# Altium schematic sheet sram_cpu.SchDoc
size A2
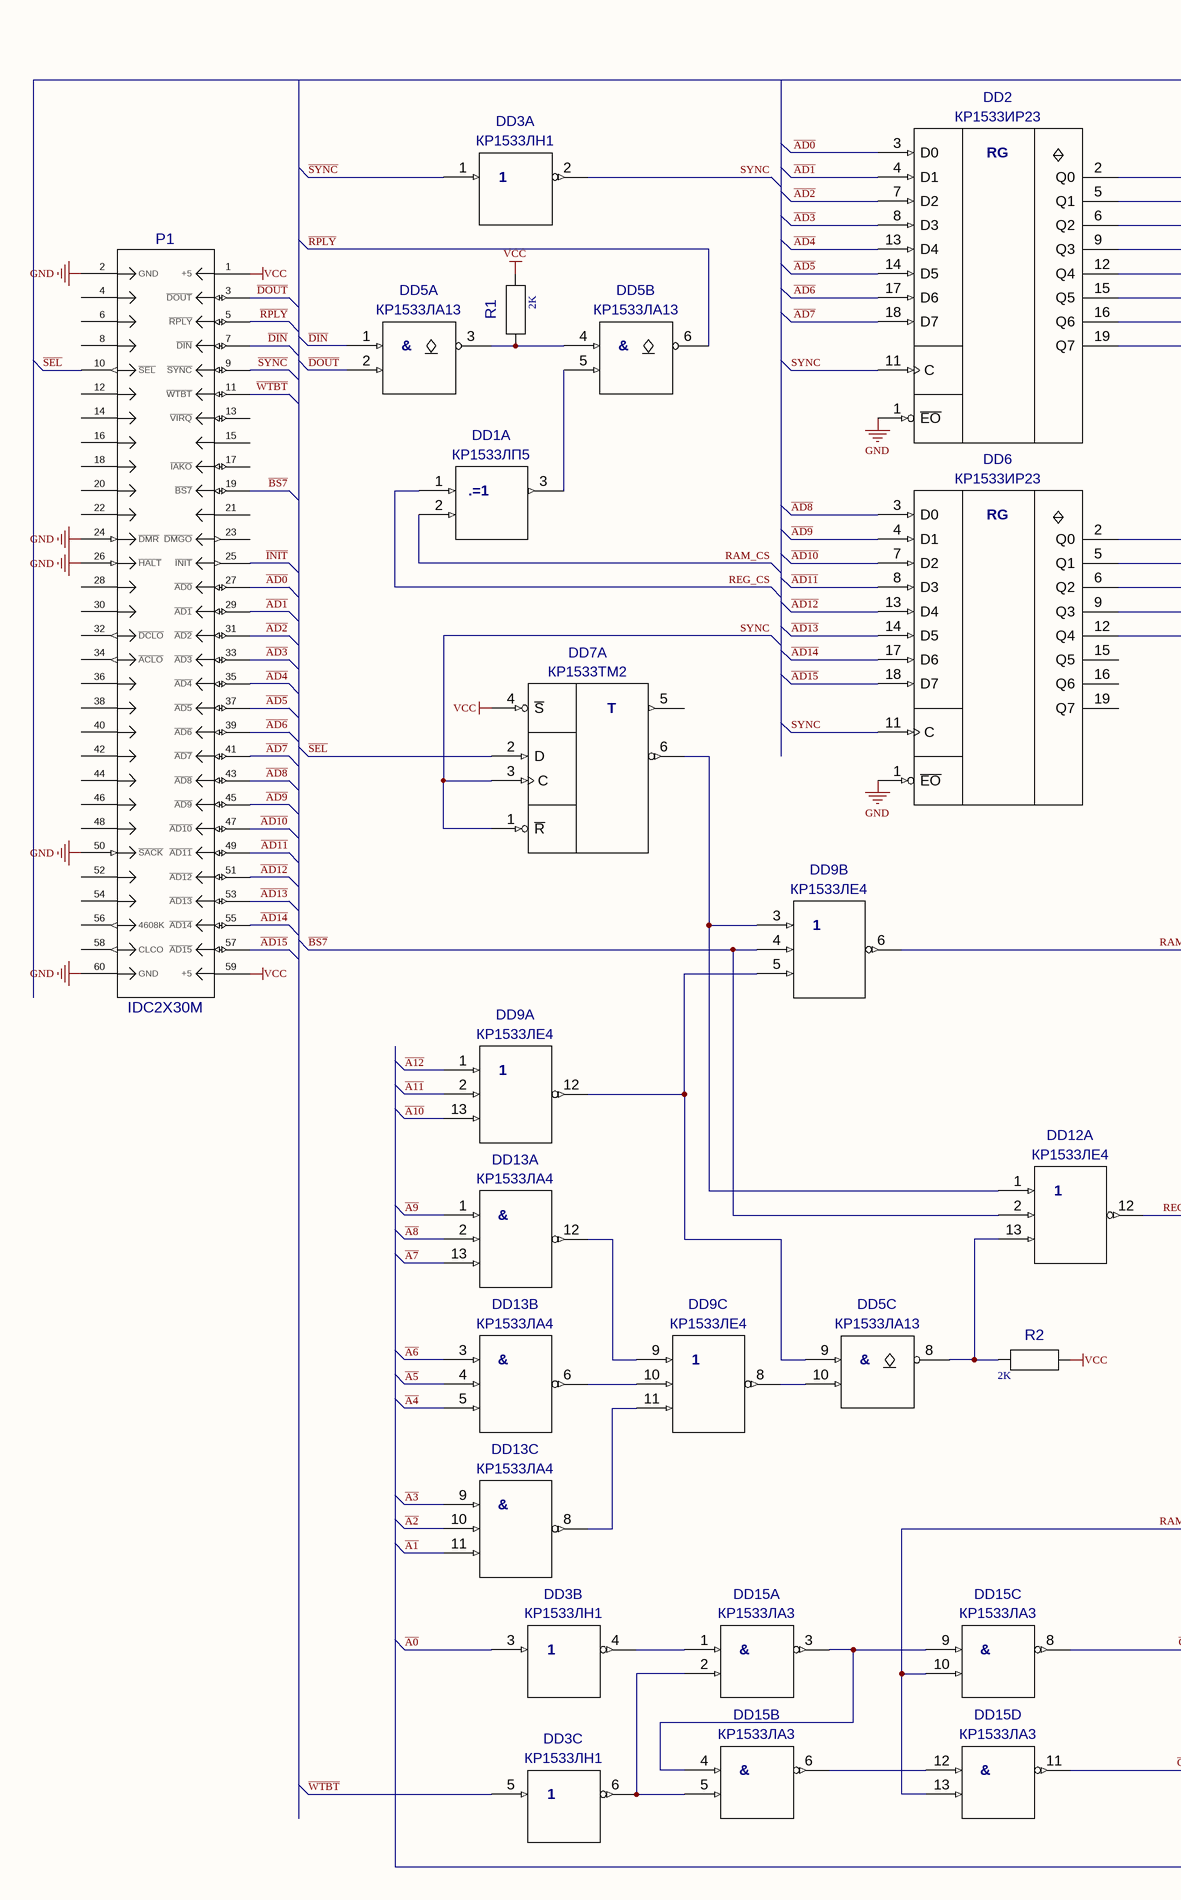
[diagram p0: sram_cpu.SchDoc, left]
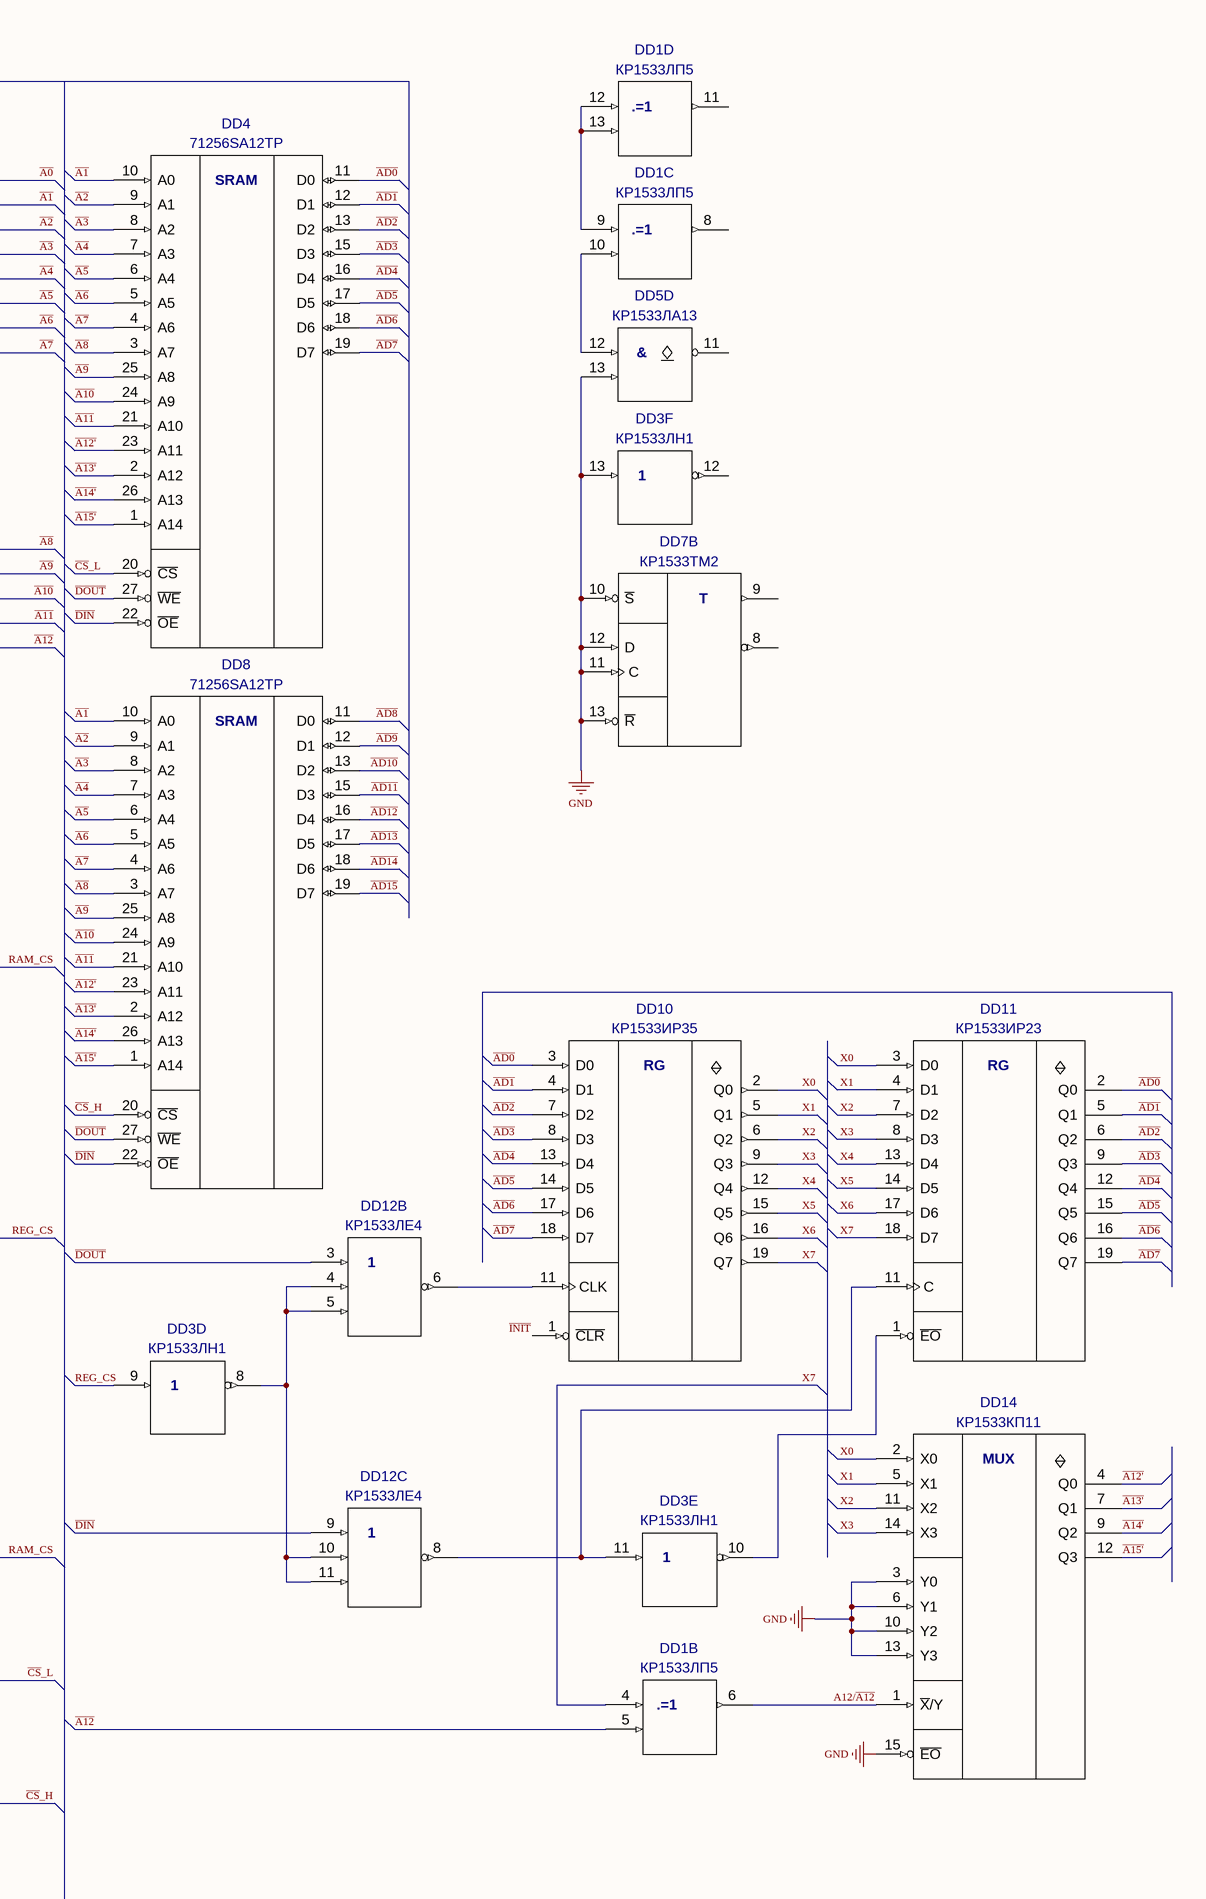
[diagram p1: sram_cpu.SchDoc, right]

## Parts
DD1  КР1533ЛП5  [2101.14-1]  (parts A,B,C,D of 4)
DD2  КР1533ИР23  [2140.20-4]
DD3  КР1533ЛН1  [2101.14-1]  (parts A,B,C,D,E,F of 6)
DD4  71256SA12TP  [DIP28]
DD5  КР1533ЛА13  [2101.14-1]  (parts A,B,C,D of 4)
DD6  КР1533ИР23  [2140.20-4]
DD7  КР1533ТМ2  [2101.14-1]  (parts A,B of 2)
DD8  71256SA12TP  [DIP28]
DD9  КР1533ЛЕ4  [2101.14-1]  (parts A,B,C of 3)
DD10  КР1533ИР35  [2140.20-4]
DD11  КР1533ИР23  [2140.20-4]
DD12  КР1533ЛЕ4  [2101.14-1]  (parts A,B,C of 3)
DD13  КР1533ЛА4  [2101.14-1]  (parts A,B,C of 3)
DD14  КР1533КП11  [2103.16-1]
DD15  КР1533ЛА3  [2101.14-1]  (parts A,B,C,D of 4)
P1  IDC2X30M  [IDC60M]
R1  value 2K  [R0125A]  (hidden comment: R0125A)
R2  value 2K  [R0125A]  (hidden comment: R0125A)

## Nets
GND: DD2.1(~{EO}) DD3.13 DD5.13 DD6.1(~{EO}) DD7.10(~{S}) DD7.11(C) DD7.12(D) DD7.13(~{R}) DD14.3(Y0) DD14.6(Y1) DD14.10(Y2) DD14.13(Y3) DD14.15(~{EO}) P1.2(GND) P1.24(~{DMR}) P1.26(~{HALT}) P1.50(~{SACK}) P1.60(GND)
VCC: DD7.4(~{S}) P1.1(+5) P1.59(+5) R1.2(I/OB) R2.2(I/OB)
A12/~{A12}: DD1.6 DD14.1(~{X}/Y)
~{A0}: DD2.2(Q0) DD3.3
~{A1}: DD2.5(Q1) DD4.10(A0) DD8.10(A0) DD13.11
~{A10}: DD4.24(A9) DD6.6(Q2) DD8.24(A9) DD9.13
~{A11}: DD4.21(A10) DD6.9(Q3) DD8.21(A10) DD9.2
~{A12}: DD1.5 DD6.12(Q4) DD9.1
~{A12'}: DD4.23(A11) DD8.23(A11) DD14.4(Q0)
~{A13'}: DD4.2(A12) DD8.2(A12) DD14.7(Q1)
~{A14'}: DD4.26(A13) DD8.26(A13) DD14.9(Q2)
~{A15'}: DD4.1(A14) DD8.1(A14) DD14.12(Q3)
~{A2}: DD2.6(Q2) DD4.9(A1) DD8.9(A1) DD13.10
~{A3}: DD2.9(Q3) DD4.8(A2) DD8.8(A2) DD13.9
~{A4}: DD2.12(Q4) DD4.7(A3) DD8.7(A3) DD13.5
~{A5}: DD2.15(Q5) DD4.6(A4) DD8.6(A4) DD13.4
~{A6}: DD2.16(Q6) DD4.5(A5) DD8.5(A5) DD13.3
~{A7}: DD2.19(Q7) DD4.4(A6) DD8.4(A6) DD13.13
~{A8}: DD4.3(A7) DD6.2(Q0) DD8.3(A7) DD13.2
~{A9}: DD4.25(A8) DD6.5(Q1) DD8.25(A8) DD13.1
~{AD0}: DD2.3(D0) DD4.11(D0) DD10.3(D0) DD11.2(Q0) P1.27(~{AD0})
~{AD1}: DD2.4(D1) DD4.12(D1) DD10.4(D1) DD11.5(Q1) P1.29(~{AD1})
~{AD10}: DD6.7(D2) DD8.13(D2) P1.47(~{AD10})
~{AD11}: DD6.8(D3) DD8.15(D3) P1.49(~{AD11})
~{AD12}: DD6.13(D4) DD8.16(D4) P1.51(~{AD12})
~{AD13}: DD6.14(D5) DD8.17(D5) P1.53(~{AD13})
~{AD14}: DD6.17(D6) DD8.18(D6) P1.55(~{AD14})
~{AD15}: DD6.18(D7) DD8.19(D7) P1.57(~{AD15})
~{AD2}: DD2.7(D2) DD4.13(D2) DD10.7(D2) DD11.6(Q2) P1.31(~{AD2})
~{AD3}: DD2.8(D3) DD4.15(D3) DD10.8(D3) DD11.9(Q3) P1.33(~{AD3})
~{AD4}: DD2.13(D4) DD4.16(D4) DD10.13(D4) DD11.12(Q4) P1.35(~{AD4})
~{AD5}: DD2.14(D5) DD4.17(D5) DD10.14(D5) DD11.15(Q5) P1.37(~{AD5})
~{AD6}: DD2.17(D6) DD4.18(D6) DD10.17(D6) DD11.16(Q6) P1.39(~{AD6})
~{AD7}: DD2.18(D7) DD4.19(D7) DD10.18(D7) DD11.19(Q7) P1.41(~{AD7})
~{AD8}: DD6.3(D0) DD8.11(D0) P1.43(~{AD8})
~{AD9}: DD6.4(D1) DD8.12(D1) P1.45(~{AD9})
~{BS7}: DD9.4 DD12.2 P1.19(~{BS7})
~{CS}_H: DD8.20(~{CS}) DD15.11
~{CS}_L: DD4.20(~{CS}) DD15.8
~{DIN}: DD4.22(~{OE}) DD5.1 DD8.22(~{OE}) DD12.9 P1.7(~{DIN})
~{DOUT}: DD4.27(~{WE}) DD5.2 DD8.27(~{WE}) DD12.3 P1.3(~{DOUT})
~{INIT}: DD10.1(~{CLR}) P1.25(~{INIT})
~{RPLY}: DD5.6 P1.5(~{RPLY})
RAM_CS: DD1.2 DD9.6 DD15.10 DD15.13
REG_CS: DD1.1 DD3.9 DD12.12
~{SEL}: DD7.2(D) P1.10(~{SEL})
~{SYNC}: DD3.1 P1.9(~{SYNC})
SYNC: DD2.11(C) DD3.2 DD6.11(C) DD7.1(~{R}) DD7.3(C)
~{WTBT}: DD3.5 P1.11(~{WTBT})
X0: DD10.2(Q0) DD11.3(D0) DD14.2(X0)
X1: DD10.5(Q1) DD11.4(D1) DD14.5(X1)
X2: DD10.6(Q2) DD11.7(D2) DD14.11(X2)
X3: DD10.9(Q3) DD11.8(D3) DD14.14(X3)
X4: DD10.12(Q4) DD11.13(D4)
X5: DD10.15(Q5) DD11.14(D5)
X6: DD10.16(Q6) DD11.17(D6)
X7: DD1.4 DD10.19(Q7) DD11.18(D7)
NetDD1_3: DD1.3 DD5.5
NetDD1_9: DD1.9 DD1.12 DD1.13
NetDD1_10: DD1.10 DD5.12
NetDD3_4: DD3.4 DD15.1
NetDD3_6: DD3.6 DD15.2 DD15.5
NetDD3_8: DD3.8 DD12.4 DD12.5 DD12.10 DD12.11
NetDD3_10: DD3.10 DD11.1(~{EO})
NetDD3_11: DD3.11 DD11.11(C) DD12.8
NetDD5_3: DD5.3 DD5.4 R1.1(I/OA)
NetDD5_8: DD5.8 DD12.13 R2.1(I/OA)
NetDD5_9: DD5.9 DD9.5 DD9.12
NetDD5_10: DD5.10 DD9.8
NetDD7_6: DD7.6 DD9.3 DD12.1
NetDD9_9: DD9.9 DD13.12
NetDD9_10: DD9.10 DD13.6
NetDD9_11: DD9.11 DD13.8
NetDD10_11: DD10.11(CLK) DD12.6
NetDD15_3: DD15.3 DD15.4 DD15.9
NetDD15_6: DD15.6 DD15.12

Not connected (* = marked no-connect by the designer): DD1 7(GND) 8 11 14(+5V); DD2 10(GND) 20(+5V); DD3 7(GND) 12 14(+5V); DD4 14(GND) 28(Vcc); DD5 7(GND) 11 14(+5V); DD6 10(GND) 15(Q5) 16(Q6) 19(Q7) 20(+5V); DD7 5 7(GND) 8 9 14(+5V); DD8 14(GND) 28(Vcc); DD9 7(GND) 14(+5V); DD10 10(GND) 20(+5V); DD11 10(GND) 20(+5V); DD12 7(GND) 14(+5V); DD13 7(GND) 14(+5V); DD14 8(GND) 16(+5V); DD15 7(GND) 14(+5V); P1 4 6 8 12 13(~{VIRQ}) 14 15(P8) 16(P8) 17(~{IAKO}) 18 20 21(P11) 22(P11) 23(~{DMGO}) 28 30 32(~{DCLO}) 34(~{ACLO}) 36 38 40 42 44 46 48 52 54 56(4608K) 58(CLCO)

## Notes on the sheet
- (in symbol 71256SA) SRAM
- (in symbol КР1533ИР23(74ALS374)) RG
- (in symbol КР1533ИР35(74ALS273)) RG
- (in symbol КР1533КП11(74ALS257)) MUX
- (in symbol КР1533ЛА3(74ALS00), part A) &
- (in symbol КР1533ЛА3(74ALS00), part B) &
- (in symbol КР1533ЛА3(74ALS00), part C) &
- (in symbol КР1533ЛА3(74ALS00), part D) &
- (in symbol КР1533ЛА4(74ALS10), part A) &
- (in symbol КР1533ЛА4(74ALS10), part B) &
- (in symbol КР1533ЛА4(74ALS10), part C) &
- (in symbol КР1533ЛА13(74ALS38), part A) &
- (in symbol КР1533ЛА13(74ALS38), part B) &
- (in symbol КР1533ЛА13(74ALS38), part C) &
- (in symbol КР1533ЛА13(74ALS38), part D) &
- (in symbol КР1533ЛП5(74ALS86), part A) .=1
- (in symbol КР1533ЛП5(74ALS86), part B) .=1
- (in symbol КР1533ЛП5(74ALS86), part C) .=1
- (in symbol КР1533ЛП5(74ALS86), part D) .=1
- (in symbol КР1533ТМ2(74ALS74), part A) T
- (in symbol КР1533ТМ2(74ALS74), part B) T

## Library data of the parts
DD1 = КР1533ЛП5(74ALS86): Value: *
DD2 DD6 DD11 = КР1533ИР23(74ALS374): Value: *
DD3 = КР1533ЛН1(74ALS04): Value: *
DD4 DD8 = 71256SA: Value: *
DD5 = КР1533ЛА13(74ALS38): Value: *
DD7 = КР1533ТМ2(74ALS74): Value: *
DD9 DD12 = КР1533ЛЕ4(74ALS27): Value: *
DD10 = КР1533ИР35(74ALS273): Value: *
DD13 = КР1533ЛА4(74ALS10): Value: *
DD14 = КР1533КП11(74ALS257): Value: *
DD15 = КР1533ЛА3(74ALS00): Value: *
P1 = IDC2X30M_A: IDC Header; Value: *
R1 R2 = R0125A: PDIF_TY: 11107